# EAGLE design Mergen Ground Station_V2.0 (EAGLE 9.6.2)
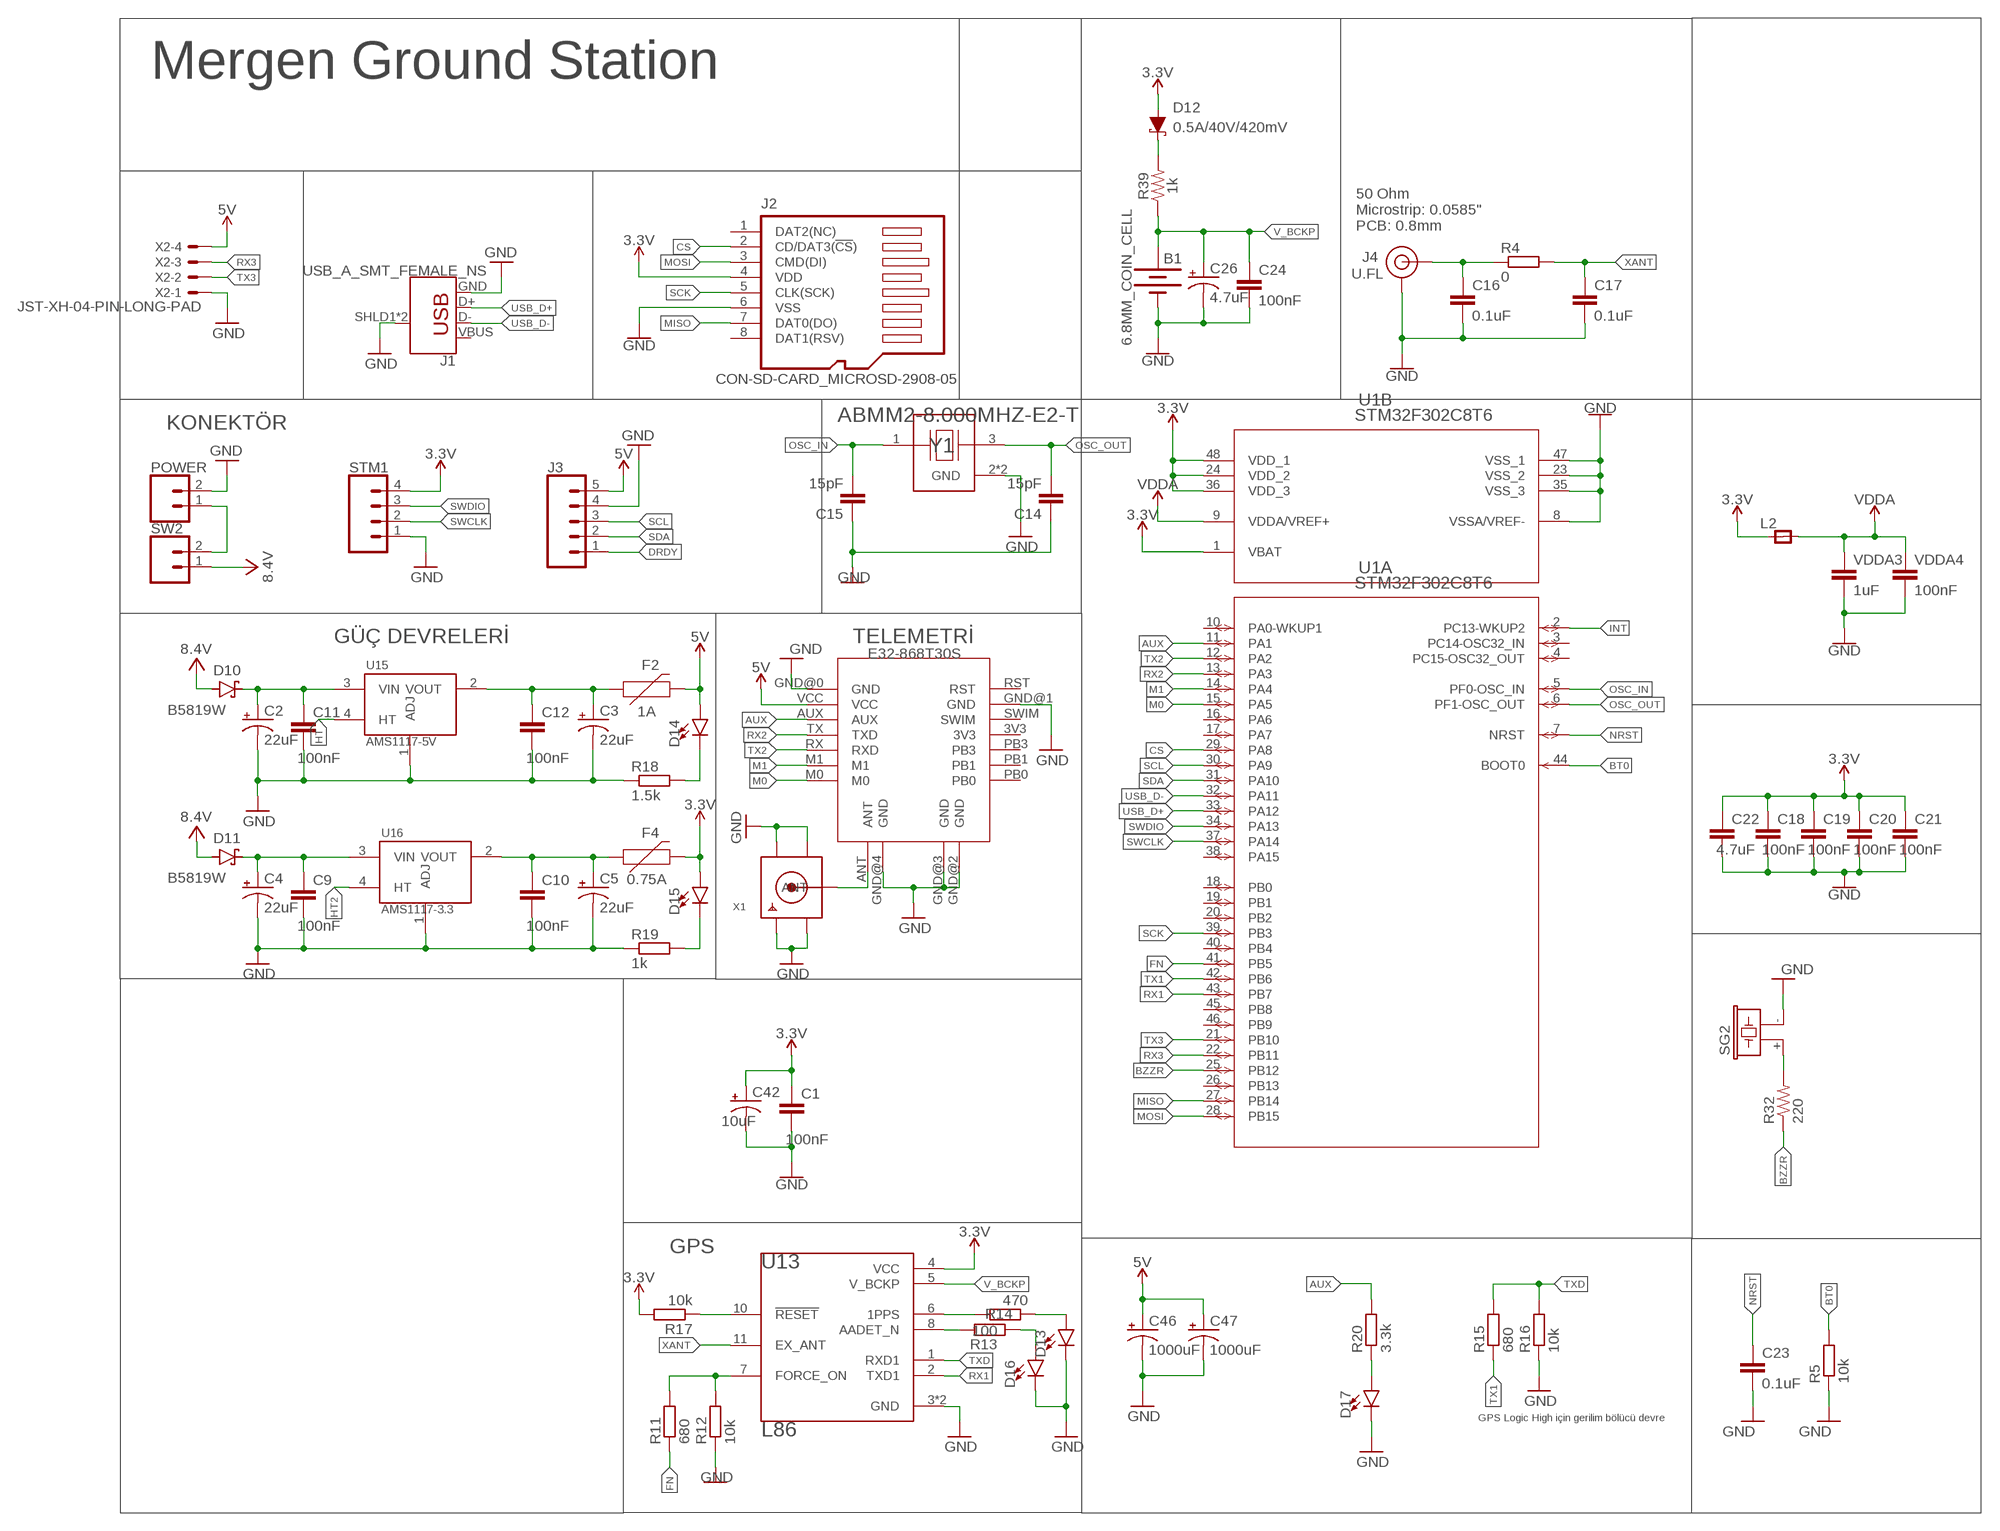
[diagram p0: schematic, sheet 1]

## Parts
B1  6.8MM_COIN_CELL  BATTERY-6.8MM_SMD  [BATTCON-6.8MM]
C1  100nF  C-EUC0603  [C0603]
C2  22uF  CPOL-USCT3528  [CT3528]
C3  22uF  CPOL-USCT3528  [CT3528]
C4  22uF  CPOL-USCT3528  [CT3528]
C5  22uF  CPOL-USCT3528  [CT3528]
C9  100nF  C-EUC0603  [C0603]
C10  100nF  C-EUC0603  [C0603]
C11  100nF  C-EUC0603  [C0603]
C12  100nF  C-EUC0603  [C0603]
C14  15pF  C-EUC0603  [C0603]
C15  15pF  C-EUC0603  [C0603]
C16  0.1uF  C-EUC0603  [C0603]
C17  0.1uF  C-EUC0603  [C0603]
C18  100nF  C-EUC0603  [C0603]
C19  100nF  C-EUC0603  [C0603]
C20  100nF  C-EUC0603  [C0603]
C21  100nF  C-EUC0603  [C0603]
C22  4.7uF  C-EUC0603  [C0603]
C23  0.1uF  C-EUC0603  [C0603]
C24  100nF  C-EUC0603  [C0603]
C26  4.7uF  CPOL-USA/3216-18R  [A/3216-18R]
C42  10uF  10UF-POLAR-EIA3216-16V-10%(TANT)  [EIA3216]
C46  1000uF  CPOL-US150CLZ-1010  [150CLZ-1010]
C47  1000uF  CPOL-US150CLZ-1010  [150CLZ-1010]
D10  B5819W  SCHOTTKY_MBR0520LT1GDO-219  [SODFL3718X115]
D11  B5819W  SCHOTTKY_MBR0520LT1GDO-219  [SODFL3718X115]
D12  0.5A/40V/420mV  DIODE-SCHOTTKY-PMEG4005EJ  [SOD-323]
D13  LED0603  [LED-0603]
D14  LED0603  [LED-0603]
D15  LED0603  [LED-0603]
D16  LED0603  [LED-0603]
D17  LED0603  [LED-0603]
F2  1A  PPTC_HALF-AMP  [1206]
F4  0.75A  PPTC_HALF-AMP  [1206]
J1  USB_A_SMT_FEMALE_NS  [USB-A-S-NOSILK-FEMALE]
J2  CON-SD-CARD_MICROSD-2908-05  [CON-SD-CARD_2908-05]
J3  CONN_05LOCK_LONGPADS  [1X05_LOCK_LONGPADS]
J4  U.FL  U.FL2PIN  [U.FL]
L2  RC-MASTER-SMD_FB_0805MP  [RC-MASTER-SMD_L0805MP]
POWER  CONN_023.5MM-NO_SILK  [SCREWTERMINAL-3.5MM-2-NS]
R4  0  R-EU_R0603  [R0603]
R5  10k  R-EU_R0603  [R0603]
R11  680  R-EU_R0603  [R0603]
R12  10k  R-EU_R0603  [R0603]
R13  100  R-EU_R0603  [R0603]
R14  470  R-EU_R0603  [R0603]
R15  680  R-EU_R0603  [R0603]
R16  10k  R-EU_R0603  [R0603]
R17  10k  R-EU_R0603  [R0603]
R18  1.5k  R-EU_R0603  [R0603]
R19  1k  R-EU_R0603  [R0603]
R20  3.3k  R-EU_R0603  [R0603]
R32  220  0OHM-0603-1/10W-5%  [0603]
R39  1k  1KOHM-0603-1/10W-1%  [0603]
SG2  F/CM12P  [F/CM12P]
STM1  CONN_04  [1X04]
SW2  CONN_023.5MM-NO_SILK  [SCREWTERMINAL-3.5MM-2-NS]
U1  STM32F302C8T6  [LQFP48-7X7MM]
U13  L86  [XCVR_L86]
U14  E32-868T30S  [E32-868T30S]
U15  AMS1117-5V  AMS1117-3.3  [SOT229P700X180-4N]
U16  AMS1117-3.3  [SOT229P700X180-4N]
VDDA3  1uF  0.1UF-0603-25V-(+80/-20%)  [0603]
VDDA4  100nF  0.1UF-0603-25V-(+80/-20%)  [0603]
X1  SMACONNECTOR  [SMA90_DIP]
X2  JST-XH-04-PIN-LONG-PAD  [JST-XH-04-PACKAGE-LONG-PAD]
Y1  ABMM2-8.000MHZ-E2-T  [XTAL_ABMM2-8.000MHZ-E2-T]

## Nets
3.3V: C1.1 C18.1 C19.1 C20.1 C21.1 C22.1 C42.+ D12.A D15.A F4.2 J2.4(VDD) L2.1 R17.2 STM1.4 U1.1(B:VBAT) U1.24(B:VDD_2) U1.36(B:VDD_3) U1.48(B:VDD_1) U13.4(VCC)
5V: C46.+ C47.+ D14.A F2.2 J3.5 U14.VCC X2.4
AUX: R20.2 U1.11(A:PA1) U14.AUX
BT0: R5.2 U1.44(A:BOOT0)
BZZR: R32.1 U1.25(A:PB12)
CS: J2.2(CD/DAT3(!CS!)) U1.29(A:PA8)
DRDY: J3.1
FN: R11.1 U1.41(A:PB5)
GND: B1.- C1.2 C2.- C3.- C4.- C5.- C9.2 C10.2 C11.2 C12.2 C14.1 C15.1 C16.2 C17.2 C18.2 C19.2 C20.2 C21.2 C22.2 C23.2 C24.2 C26.- C42.- C46.- C47.- D13.C D16.C D17.C J1.GND J1.SHLD1(SHIELD) J1.SHLD2(SHIELD) J2.6(VSS) J3.4 J4.1(GND) J4.2(GND) POWER.2 R5.1 R12.1 R16.1 R18.1 R19.1 SG2.- STM1.1 U1.8(B:VSSA/VREF-) U1.23(B:VSS_2) U1.35(B:VSS_3) U1.47(B:VSS_1) U13.3(GND) U13.12(GND) U14.GND@0(GND) U14.GND@1(GND) U14.GND@2(GND) U14.GND@3(GND) U14.GND@4(GND) U15.1(ADJ) U16.1(ADJ) VDDA3.2 VDDA4.2 X1.GND1 X1.GND2 X1.GND3 X1.GND4 X2.1 Y1.2(GND) Y1.4(GND)
HT: U15.4(HT)
HT2: U16.4(HT)
INT: U1.2(A:PC13-WKUP2)
M0: U1.15(A:PA5) U14.M0
M1: U1.14(A:PA4) U14.M1
MISO: J2.7(DAT0(DO)) U1.27(A:PB14)
MOSI: J2.3(CMD(DI)) U1.28(A:PB15)
N$2: D16.A R13.1
N$22: C2.+ C11.1 D10.1(C) U15.3(VIN)
N$23: C3.+ C12.1 F2.1 U15.2(VOUT)
N$24: C4.+ C9.1 D11.1(C) U16.3(VIN)
N$25: C5.+ C10.1 F4.1 U16.2(VOUT)
N$27: U14.ANT X1.ANTENNA(ANT)
N$28: R32.2 SG2.+
N$30: POWER.1 SW2.2
N$31: D12.C R39.2
N$32: R17.1 U13.10(!RESET)
N$33: R14.2 U13.6(1PPS)
N$34: D13.A R14.1
N$35: D14.C R18.2
N$36: D15.C R19.2
N$37: R13.2 U13.8(AADET_N)
N$39: C16.1 J4.FEED(SIGNAL) R4.1
N$40: R11.2 R12.2 U13.7(FORCE_ON)
N$41: D17.A R20.1
NRST: C23.1 U1.7(A:NRST)
OSC_IN: C15.2 U1.5(A:PF0-OSC_IN) Y1.1
OSC_OUT: C14.2 U1.6(A:PF1-OSC_OUT) Y1.3
RX1: U1.43(A:PB7) U13.2(TXD1)
RX2: U1.13(A:PA3) U14.TX(TXD)
RX3: U1.22(A:PB11) X2.3
SCK: J2.5(CLK(SCK)) U1.39(A:PB3)
SCL: J3.3 U1.30(A:PA9)
SDA: J3.2 U1.31(A:PA10)
SWCLK: STM1.2 U1.37(A:PA14)
SWDIO: STM1.3 U1.34(A:PA13)
TX1: R15.1 U1.42(A:PB6)
TX2: U1.12(A:PA2) U14.RX(RXD)
TX3: U1.21(A:PB10) X2.2
TXD: R15.2 R16.2 U13.1(RXD1)
USB_D+: J1.D+ U1.33(A:PA12)
USB_D-: J1.D- U1.32(A:PA11)
V_BCKP: B1.+ C24.1 C26.+ R39.1 U13.5(V_BCKP)
VCC: D10.2(A) D11.2(A) SW2.1 ; supply symbol labelled 8.4V
VDDA: L2.2 U1.9(B:VDDA/VREF+) VDDA3.1 VDDA4.1
XANT: C17.1 R4.2 U13.11(EX_ANT)
Unconnected: J2.1(DAT2(NC)) J2.8(DAT1(RSV)) J2.GND@1(GND) J2.GND@2(GND) J2.GND@3(GND) J2.GND@4(GND) U1.3(A:PC14-OSC32_IN) U1.4(A:PC15-OSC32_OUT) U1.10(A:PA0-WKUP1) U1.16(A:PA6) U1.17(A:PA7) U1.18(A:PB0) U1.19(A:PB1) U1.20(A:PB2) U1.26(A:PB13) U1.38(A:PA15) U1.40(A:PB4) U1.45(A:PB8) U1.46(A:PB9) U14.3V3 U14.PB0 U14.PB1 U14.PB3 U14.RST U14.SWIM

## Notes on the sheet
- Mergen Ground Station
- 50 Ohm 
  Microstrip: 0.0585"
  PCB: 0.8mm
- KONEKTÖR
- GÜÇ DEVRELERİ | TELEMETRİ
- GPS
- GPS Logic High için gerilim bölücü devre

## Power pins joined to a net without a drawn wire
VBUS: J1.VBUS

## Library data of the parts
B1 = SparkFun-Batteries:BATTERY: Battery - Single Cell A variety of battery chemistries, sizes, and footprints. Device List: 20MM_PTH - Coin Cell Battery Holder - 20mm (PTH) <https://www.sparkfun.com/products/783> 6.8MM_PTH - Coin Cell Battery Holder - 6.8MM(SMD) <https://www.digikey.com/product-detail/en/seiko-instruments/MS621FE-FL11E/728-1057-ND/1889208?WT.srch=1&gclid=CNOQ5a6LzdQCFZS2wAodXCkE0g> 12MM_SMD - Coin Cell Battery Holder - 12mm (SMD) <https://www.sparkfun.com/products/10592> 12MM_PTH - Coin Cell Battery Holder - 12mm (PTH) <https://www.sparkfun.com/products/7948> 20MM_SMD - 20mm Coin Cell Battery Holder (SMD) (2 legs) Used on the Big Time Watch Kit <https://www.sparkfun.com/products/11734> 20MM_SMD_4LEGS - Coin Cell Battery Holder - 20mm (SMD) <https://www.sparkfun.com/products/11892> 20MM_SMD_4LEGS_OVERPASTE - Coin Cell Battery Holder - 20mm (SMD) <https://www.sparkfun.com/products/11892> (Over-paste on the legs) 24.5MM_PTH - Coin Cell Battery Holder - 24.5mm (PTH) <https://www.sparkfun.com/products/8863> 9V - 9V Battery Holder - PC Mount Used on the SparkFun SparkPunk Sound Kit <https://www.sparkfun.com/products/11177> and SparkFun SparkPunk Sequencer Kit <https://www.sparkfun.com/products/12707> 18650 - Battery Holder - 18650 (PTH) <https://www.sparkfun.com/products/13113> AA - Battery Holder - 1xAA (PTH) <https://www.sparkfun.com/products/7949> AAA - Battery Holder - 1xAAA (PTH) <https://www.sparkfun.com/products/12718> AA_KIT - Battery Holder - 1xAA (PTH) <https://www.sparkfun.com/products/7949> Special kit package - pads only have exposed copper on one side of the board. AAA_KIT - Battery Holder - 1xAAA (PTH) <https://www.sparkfun.com/products/12718> Special kit package - pads only have exposed copper on one side of the board.; PROD_ID: BATT-13734
C1 C9-C12 C14-C24 = rcl:C-EU: CAPACITOR, European symbol; SPICEPREFIX: C
C2-C5 C26 = rcl:CPOL-US: POLARIZED CAPACITOR, American symbol; SPICEPREFIX: C
C42 = SparkFun-Capacitors:10UF-POLAR: 10.0µF polarized capacitors A capacitor is a passive two-terminal electrical component used to store electrical energy temporarily in an electric field.; PROD_ID: CAP-00811
C46 C47 = adafruit:CPOL-US: POLARIZED CAPACITOR, American symbol
D10 D11 = Diode:SCHOTTKY_: Schottky Diode - Popular parts; CATEGORY: Diode; DESCRIPTION: DIODE SCHOTTKY 20V 500MA SOD123; MANUFACTURER: ON Semiconductor; MPN: MBR0520LT1G; SUB-CATEGORY: Schottky; VALUE: MBR0520LT1G
D12 = SparkFun-DiscreteSemi:DIODE-SCHOTTKY: Schottky diode A Schottky diode is a semiconductor diode which has a low forward voltage drop and a very fast switching action.; PROD_ID: DIO-10955
D13-D17 = SparkFun-LED:LED: LED (Generic) Standard schematic elements and footprints for 5mm, 3mm, 1206, and 0603 sized LEDs. Generic LEDs with no color specified.
F2 F4 = SparkFun-Fuses:PPTC: Resettable Fuse PPTC Resettable Fuse. Really a sort of resistor with a polymeric positive temperature coefficient whose resistance increases dramatically with an increase in temperature. When heated by the power passing through the resistance rises causing the current to be limited, protecting the circuit. This is achieved by the transition of the polymer from a crystalline to an amorphous state where the conductive carbon separates breaking the conductive pathways found in the cool crystalline structure. When a PPTC cools back down it resumes conducting letting the circuit turn back on. SparkFun Products: SparkFun RedBoard - Programmed with Arduino <https://www.sparkfun.com/products/12757> Pro Micro - 5V/16MHz <https://www.sparkfun.com/products/12640> Arduino Pro 328 - 5V/16MHz <https://www.sparkfun.com/products/10915> MP3 Trigger <https://www.sparkfun.com/products/13720>; PROD_ID: RES-08585; VALUE: 6V/0.5A
J1 = SparkFun-Connectors:USB_A: USB-A Connector Male and female variants, as well as PTH and SMT variants SparkFun Products: SparkFun XBee Explorer Dongle <https://www.sparkfun.com/products/11697> PTH Male SparkFun MicroView-USB Programmer <https://www.sparkfun.com/products/12924> SMT Male SparkFun USB Type A Female Breakout <https://www.sparkfun.com/products/12700> SMT Female; PROD_ID: CONN-09520; SF_ID: PRT-09011
J2 = 52101-101-REV-A_v16:CON-SD-CARD_MICROSD-: microSD Connector
J3 = SparkFun-Connectors:CONN_05: Multi connection point. Often used as Generic Header-pin footprint for 0.1 inch spaced/style header connections On any of the 0.1 inch spaced packages, you can populate with these: Break Away Headers - Straight <https://www.sparkfun.com/products/116> (PRT-00116) Break Away Male Headers - Right Angle <https://www.sparkfun.com/products/553> (PRT-00553) Female Headers <https://www.sparkfun.com/products/115> (PRT-00115) Break Away Headers - Machine Pin <https://www.sparkfun.com/products/117> (PRT-00117) Break Away Female Headers - Swiss Machine Pin <https://www.sparkfun.com/products/743> (PRT-00743) For SCREWTERMINALS and SPRING TERMINALS visit here: Screw Terimnals on SparkFun.com <https://www.sparkfun.com/search/results?term=Screw+Terminals> (5mm/3.5mm/2.54mm spacing) This device is also useful as a general connection point to wire up your design to another part of your project. Our various solder wires solder well into these plated through hole pads. Hook-Up Wire - Assortment (Stranded, 22 AWG) <https://www.sparkfun.com/products/11375> (PRT-11375) Hook-Up Wire - Assortment (Solid Core, 22 AWG) <https://www.sparkfun.com/products/11367> (PRT-11367) View the entire wire category on our website here <https://www.sparkfun.com/categories/141> Special notes: Molex polarized connector foot print use with SKU : PRT-08231 with associated crimp pins and housings. 1MM SMD Version SKU: PRT-10208
J4 = SparkFun-Connectors:U.FL2PIN: SMD Antenna Connector - U.FL 2mm height, 3.0mm x 3.0mm receptacle size. SparkFun Products: SparkFun WiFi Shield - ESP8266 <https://www.sparkfun.com/products/13287> SparkFun ESP8266 Thing <https://www.sparkfun.com/products/13231> SparkFun MiniGen - Pro Mini Signal Generator Shield <https://www.sparkfun.com/products/11420>; PROD_ID: CONN-09193; SF_ID: WRL-09144
L2 = 52101-101-REV-A_v16:RC-MASTER-SMD_FB_: FERRITE BEAD
POWER SW2 = SparkFun-Connectors:CONN_02: Multi connection point. Often used as Generic Header-pin footprint for 0.1 inch spaced/style header connections On any of the 0.1 inch spaced packages, you can populate with these: Break Away Headers - Straight <https://www.sparkfun.com/products/116> (PRT-00116) Break Away Male Headers - Right Angle <https://www.sparkfun.com/products/553> (PRT-00553) Female Headers <https://www.sparkfun.com/products/115> (PRT-00115) Break Away Headers - Machine Pin <https://www.sparkfun.com/products/117> (PRT-00117) Break Away Female Headers - Swiss Machine Pin <https://www.sparkfun.com/products/743> (PRT-00743) For SCREWTERMINALS and SPRING TERMINALS visit here: Screw Terimnals on SparkFun.com <https://www.sparkfun.com/search/results?term=Screw+Terminals> (5mm/3.5mm/2.54mm spacing) This device is also useful as a general connection point to wire up your design to another part of your project. Our various solder wires solder well into these plated through hole pads. Hook-Up Wire - Assortment (Stranded, 22 AWG) <https://www.sparkfun.com/products/11375> (PRT-11375) Hook-Up Wire - Assortment (Solid Core, 22 AWG) <https://www.sparkfun.com/products/11367> (PRT-11367) View the entire wire category on our website here <https://www.sparkfun.com/categories/141> Special notes: Molex polarized connector foot print use with: PRT-08233 with associated crimp pins and housings. 2.54_SCREWTERM for use with PRT-10571. 3.5mm Screw Terminal footprints for PRT-08084 5mm Screw Terminal footprints for use with PRT-08432; PROD_ID: CONN-08399
R4 R5 R11-R20 = rcl:R-EU_: RESISTOR, European symbol; SPICEPREFIX: R
R32 = SparkFun-Resistors:0OHM: 0Ω resistor A resistor is a passive two-terminal electrical component that implements electrical resistance as a circuit element. Resistors act to reduce current flow, and, at the same time, act to lower voltage levels within circuits. - Wikipedia; PROD_ID: RES-08609; VALUE: 0
R39 = SparkFun-Resistors:1KOHM: 1kΩ resistor A resistor is a passive two-terminal electrical component that implements electrical resistance as a circuit element. Resistors act to reduce current flow, and, at the same time, act to lower voltage levels within circuits. - Wikipedia; PROD_ID: RES-07856
SG2 = buzzer:F/CM12P: BUZZER Source: Buerklin; OC_FARNELL: unknown; OC_NEWARK: unknown
STM1 = SparkFun-Connectors:CONN_04: Multi connection point. Often used as Generic Header-pin footprint for 0.1 inch spaced/style header connections On any of the 0.1 inch spaced packages, you can populate with these: Break Away Headers - Straight <https://www.sparkfun.com/products/116> (PRT-00116) Break Away Male Headers - Right Angle <https://www.sparkfun.com/products/553> (PRT-00553) Female Headers <https://www.sparkfun.com/products/115> (PRT-00115) Break Away Headers - Machine Pin <https://www.sparkfun.com/products/117> (PRT-00117) Break Away Female Headers - Swiss Machine Pin <https://www.sparkfun.com/products/743> (PRT-00743) For SCREWTERMINALS and SPRING TERMINALS visit here: Screw Terimnals on SparkFun.com <https://www.sparkfun.com/search/results?term=Screw+Terminals> (5mm/3.5mm/2.54mm spacing) This device is also useful as a general connection point to wire up your design to another part of your project. Our various solder wires solder well into these plated through hole pads. Hook-Up Wire - Assortment (Stranded, 22 AWG) <https://www.sparkfun.com/products/11375> (PRT-11375) Hook-Up Wire - Assortment (Solid Core, 22 AWG) <https://www.sparkfun.com/products/11367> (PRT-11367) View the entire wire category on our website here <https://www.sparkfun.com/categories/141> Special notes: Molex polarized connector foot print use with SKU : PRT-08231 with associated crimp pins and housings. 1MM SMD Version SKU: PRT-10208; PROD_ID: CONN-09696
U1 = STM32F302C8T6:STM32F302C8T6; BUILT_BY: EMA_UL_Team; COPYRIGHT: Copyright (C) 2018 Accelerated Designs. All rights reserved; MANUFACTURER_PART_NUMBER: STM32F302C8T6; SOURCELIBRARY: Updates_to_database_2020-10-19; VENDOR: STMicroelectronics
U13 = L86:L86: L86 is an ultra-compact GNSS POT (Patch on Top) module with an embedded 18.4mm × 18.4mm × 4.0mm patch antenna and utilizes the MediaTek new generation GNSS chipset MT3333 that achieves the perfect performance; AVAILABILITY: Unavailable; DESCRIPTION: L86 is an ultra-compact GNSS POT (Patch on Top) module with an embedded 18.4mm × 18.4mm × 4.0mm patch antenna and utilizes the MediaTek new generation GNSS chipset MT3333 that achieves the perfect performance; MF: Quectel; MP: L86; PACKAGE: PowerSFN-8 Quectel; PRICE: None
U14 = E32-868T30S:E32-868T30S: E BYTE E32-868T30S
U15 U16 = AMS1117-3.3:AMS1117-3.3: Sot223/Pkg 1-Amp 3.3-Volt Low Drop Out Voltage Regulatator; AVAILABILITY: Unavailable; DESCRIPTION: Sot223/Pkg 1-Amp 3.3-Volt Low Drop Out Voltage Regulatator; MF: Advanced Monolithic Systems; MP: AMS1117-3.3; PACKAGE: SOT-89 ams; PRICE: None
VDDA3 VDDA4 = SparkFun-Capacitors:0.1UF: 0.1µF ceramic capacitors A capacitor is a passive two-terminal electrical component used to store electrical energy temporarily in an electric field.; PROD_ID: CAP-00810; VALUE: 0.1uF
X1 = adafruit:SMACONNECTOR: SMA Connector 90° DIP SMA Connector, 50 Ohm (4UConnector: 07259)
X2 = Rembrandt Electronics - JST XH Connectors v1-0:JST-XH-04-PIN: JST XH Connector 2 Pin Wire to board connector. Pitch: 2,54 mm, (0.100") Number of pins: 4 Created by Rembrandt Electronics www.rembrandtelectronics.com
Y1 = ABMM2-8.000MHZ-E2-T (1):ABMM2-8.000MHZ-E2-T: Check prices <https://pricing.snapeda.com/parts/ABMM2-8.000MHZ-E2-T/Abracon/view-part?ref=eda>; AVAILABILITY: Good; DESCRIPTION: 8MHz ±20ppm Crystal 18pF 72 Ohms 4-SMD, No Lead; MF: Abracon; MP: ABMM2-8.000MHZ-E2-T; PACKAGE: SMD-4 Abracon; PRICE: None; PURCHASE-URL: https://pricing.snapeda.com/search/part/ABMM2-8.000MHZ-E2-T/?ref=eda

## Board
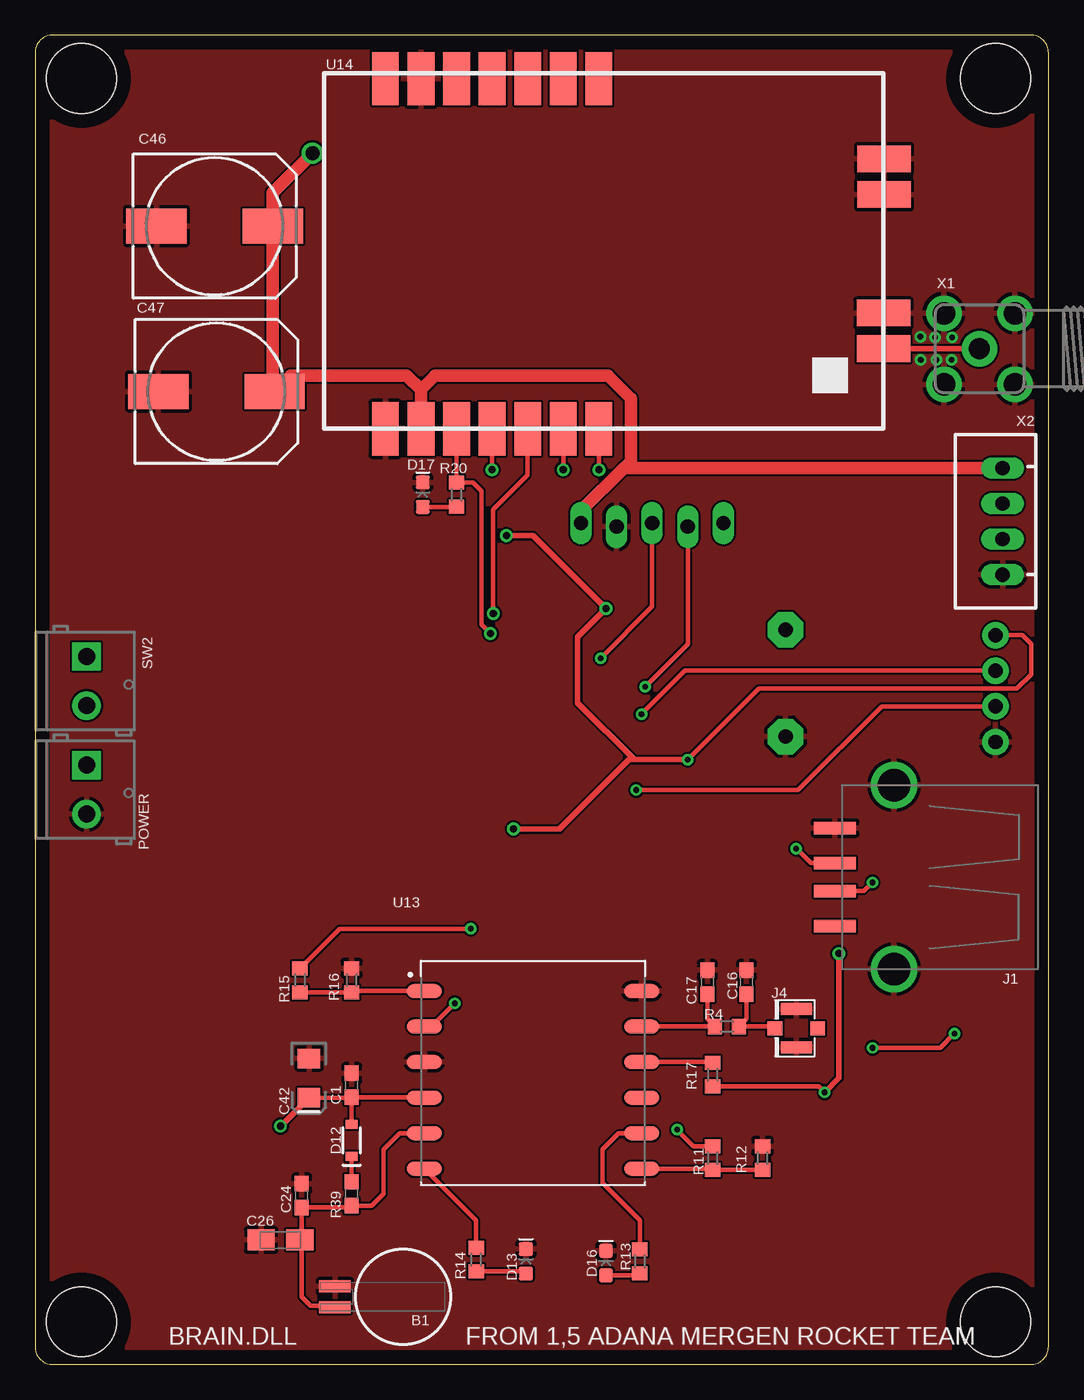
[diagram p1: board, top side]
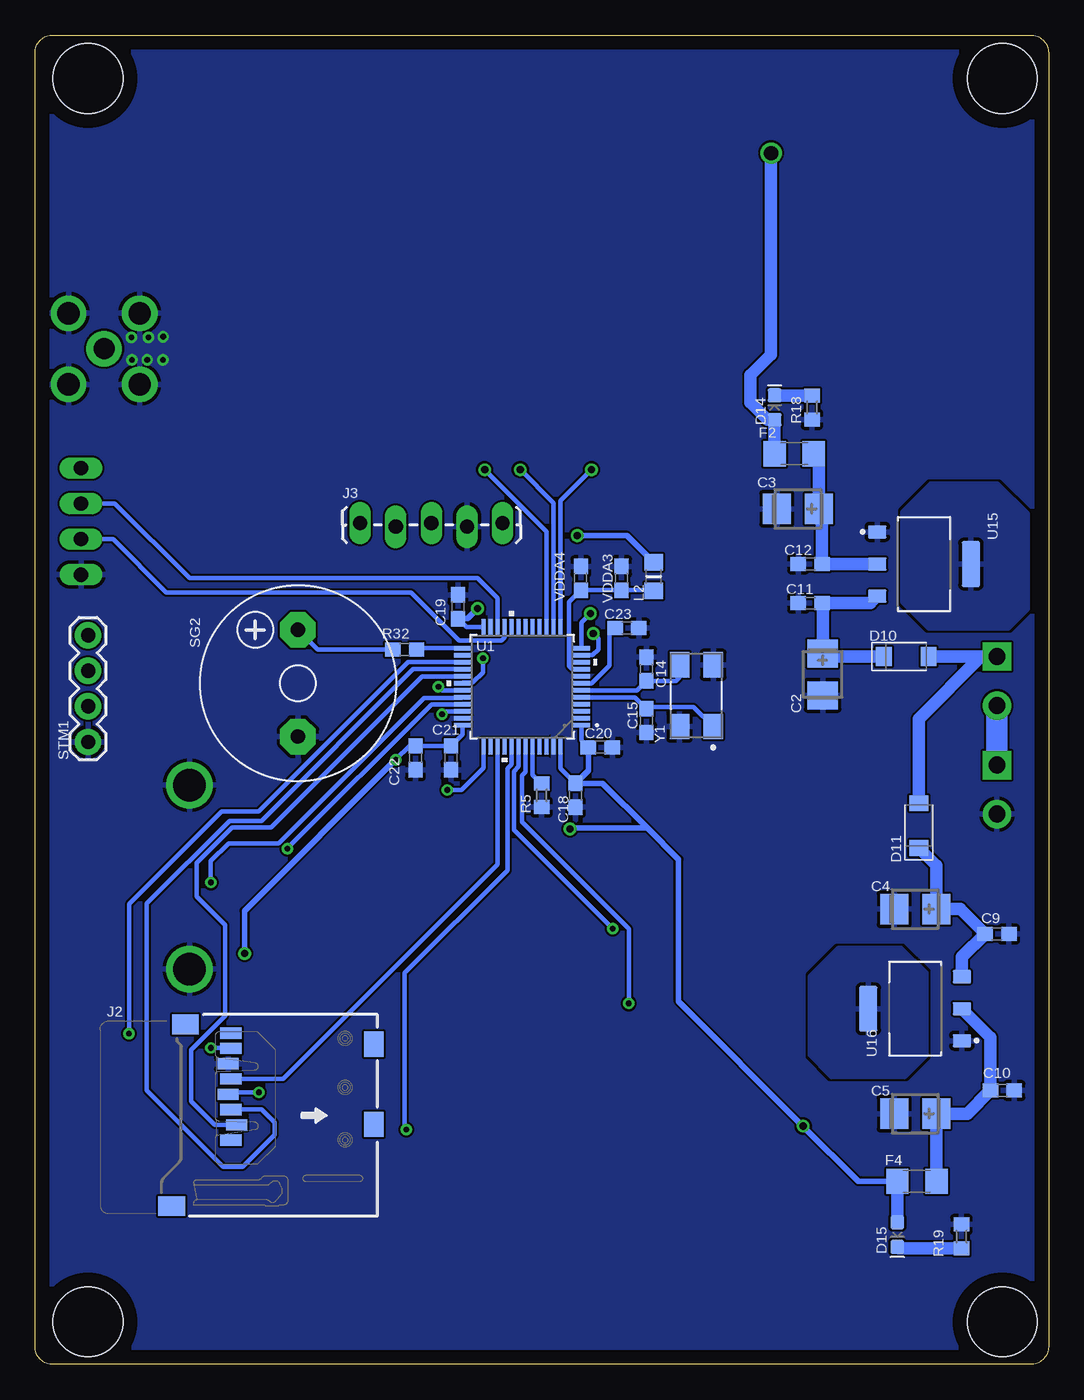
[diagram p2: board, bottom side, seen from below]

Size 72.37 x 94.92 mm. Coordinates in mm from the lower left corner, seen from the top.
Outline: 0,93.65 0,1.27 arc90 1.27,0 71.1,0 arc90 72.37,1.27 72.37,93.65 arc90 71.1,94.92 1.27,94.92 arc90 0,93.65
Copper layers (1*16): Top 0.035mm / dielectric 1.5mm / Bottom 0.035mm
Design rules "default": minimum track width 6mil, minimum drill 0.35mm, track to track 6mil, track to pad 6mil, pad to pad 6mil, via to via 6mil, smd to smd 6mil, copper to edge 40mil, drill to drill 6mil, minimum pad ring 10mil, minimum via ring 8mil, stop-mask expansion 4mil, vias tented up to drill 0mil, thermal gap 10mil
Holes 5 mm at 3.3,91.82 68.58,91.82 3.3,3.05 68.58,3.05

### Footprints (pad centres in the part's own frame; a part is rotated, then mirrored left to right if it is on the bottom)
BATTCON-6.8MM = smd 2.25 x 0.85: + 4.87,0.75; - 4.87,-0.75
C0603 = smd 1.1 x 1: 1 -0.85,0; 2 0.85,0
CT3528 = smd 2 x 2.2: + -1.5,0; - 1.5,0
A/3216-18R = smd 1.95 x 1.5: + 1.375,0; - -1.375,0
EIA3216 = smd 1.4 x 1.6: + 1.4,0; - -1.4,0
150CLZ-1010 = smd 4.3 x 2.5: + 4.15,0; - -4.15,0
SODFL3718X115 = smd 1.115 x 1.361: 1 -1.6,0; 2 1.6,0
SOD-323 = smd 0.63 x 0.83: A 1.15,0; C -1.15,0
LED-0603 = smd 1 x 1: A -0.877,0; C 0.877,0
1206 = smd 1.6 x 1.8: 1 -1.4,0; 2 1.4,0
USB-A-S-NOSILK-FEMALE = smd 3 x 0.9: D+ 6.752,-1; D- 6.752,1; GND 6.752,-3.5; VBUS 6.752,3.5 | drill 2.311: SHLD1 2.54,-6.566; SHLD2 2.54,6.566
CON-SD-CARD_2908-05 = smd 0.8 x 1.5: 1 1.761,3.847; 2 0.669,4.253; 3 -0.423,3.847; 4 -1.515,3.644; 5 -2.607,3.847; 6 -3.7,3.644; 7 -4.792,3.847; 8 -5.884,3.847 | smd 1.397 x 1.905: GND@1 -6.5,0.6; GND@2 6.473,-0.389 | smd 1.803 x 1.397: GND@3 0.631,14.059; GND@4 -5.084,14.059
1X05_LOCK_LONGPADS = drill 1.016 long: 1 0,0; 2 2.54,-0.254; 3 5.08,0; 4 7.62,-0.254; 5 10.16,0
U.FL = smd 2.2 x 0.85: 1 0,1.375; 2 0,-1.375 | smd 1.05 x 1: FEED 1.525,0; NC -1.525,0
RC-MASTER-SMD_L0805MP = smd 1.2 x 1.3: 1 -1.016,0; 2 1.016,0
SCREWTERMINAL-3.5MM-2-NS = drill 1.2 pad 2.032 square: 1 0,0 | drill 1.2 pad 2.032: 2 3.5,0
R0603 = smd 1 x 1.1: 1 -0.85,0; 2 0.85,0
0603 = smd 1.1 x 1: 1 -0.85,0; 2 0.85,0
F/CM12P = drill 1.016 pad 2.54 octagon: + 3.81,0; - -3.81,0
1X04 = drill 1.016 pad 1.88: 1 0,0; 2 2.54,0; 3 5.08,0; 4 7.62,0
LQFP48-7X7MM = smd 1.194 x 0.305: 1 -4.25,2.75; 2 -4.25,2.25; 3 -4.25,1.75; 4 -4.25,1.25; 5 -4.25,0.75; 6 -4.25,0.25; 7 -4.25,-0.25; 8 -4.25,-0.75; 9 -4.25,-1.25; 10 -4.25,-1.75; 11 -4.25,-2.25; 12 -4.25,-2.75; 25 4.25,-2.75; 26 4.25,-2.25; 27 4.25,-1.75; 28 4.25,-1.25; 29 4.25,-0.75; 30 4.25,-0.25; 31 4.25,0.25; 32 4.25,0.75; 33 4.25,1.25; 34 4.25,1.75; 35 4.25,2.25; 36 4.25,2.75 | smd 0.305 x 1.194: 13 -2.75,-4.25; 14 -2.25,-4.25; 15 -1.75,-4.25; 16 -1.25,-4.25; 17 -0.75,-4.25; 18 -0.25,-4.25; 19 0.25,-4.25; 20 0.75,-4.25; 21 1.25,-4.25; 22 1.75,-4.25; 23 2.25,-4.25; 24 2.75,-4.25; 37 2.75,4.25; 38 2.25,4.25; 39 1.75,4.25; 40 1.25,4.25; 41 0.75,4.25; 42 0.25,4.25; 43 -0.25,4.25; 44 -0.75,4.25; 45 -1.25,4.25; 46 -1.75,4.25; 47 -2.25,4.25; 48 -2.75,4.25
XCVR_L86 = smd 2.5 x 1: 1 -7.75,6.35; 2 -7.75,3.81; 3 -7.75,1.27; 4 -7.75,-1.27; 5 -7.75,-3.81; 6 -7.75,-6.35; 7 7.75,-6.35; 8 7.75,-3.81; 9 7.75,-1.27; 10 7.75,1.27; 11 7.75,3.81; 12 7.75,6.35
E32-868T30S = smd 3.81 x 1.905: 3V3 12.3,5.08; AUX -12.7,7.62; GND@0 -12.7,12.7; GND@1 12.3,10.16; M0 -12.7,-2.54; M1 -12.7,0; PB0 12.3,-2.54; PB1 12.3,0; PB3 12.3,2.54; RST 12.3,12.7; RX -12.7,2.54; SWIM 12.3,7.62; TX -12.7,5.08; VCC -12.7,10.16 | smd 1.905 x 3.81: ANT -6.97,-22.86; GND@2 6.57,-22.91; GND@3 4.03,-22.91; GND@4 -4.43,-22.86
SOT229P700X180-4N = smd 0.93 x 1.31: 1 -2.29,-3.345; 2 0,-3.345; 3 2.29,-3.345 | smd 3.24 x 1.31: 4 0,3.345
SMA90_DIP = drill 1.5 pad 2.54: ANTENNA 0,0 | drill 1.6 pad 2.54: GND1 -2.54,2.54; GND2 2.54,2.54; GND3 -2.54,-2.54; GND4 2.54,-2.54
JST-XH-04-PACKAGE-LONG-PAD = drill 1.016 long: 1 -3.81,0; 2 -1.27,0; 3 1.27,0; 4 3.81,0
XTAL_ABMM2-8.000MHZ-E2-T = smd 1.8 x 1.4: 1 -2.2,-1.2; 2 2.2,-1.2; 3 2.2,1.2; 4 -2.2,1.2

### Placement (x,y rotation side)
B1  26.29,4.83 180 top
C1  22.61,19.94 90 top
C2  16.13,49.28 270 bottom
C3  17.91,61.09 180 bottom
C4  9.52,32.51 180 bottom
C5  9.52,17.91 180 bottom
C9  3.68,30.73 0 bottom
C10  3.3,19.56 0 bottom
C11  17.02,54.36 180 bottom
C12  17.02,57.15 180 bottom
C14  28.7,49.66 270 bottom
C15  28.7,45.97 90 bottom
C16  50.8,27.3 90 top
C17  48.01,27.3 90 top
C18  33.78,40.64 270 bottom
C19  42.16,54.1 90 bottom
C20  32,44.07 0 bottom
C21  42.67,43.31 270 bottom
C22  45.21,43.31 270 bottom
C23  30.1,52.58 0 bottom
C24  19.05,12.06 90 top
C26  17.53,8.89 0 top
C42  19.56,20.45 270 top
C46  12.83,81.28 0 top
C47  12.95,69.47 0 top
D10  10.16,50.55 0 bottom
D11  9.27,38.48 90 bottom
D12  22.61,16 90 top
D13  35.05,7.37 90 top
D14  19.56,68.33 90 bottom
D15  10.79,9.27 270 bottom
D16  40.77,7.24 90 top
D17  27.69,62.1 90 top
F2  18.16,65.02 180 bottom
F4  9.4,13.08 180 bottom
J1  63.88,34.8 180 top
J2  62.23,17.78 270 bottom
J3  49.15,60.07 0 bottom
J4  54.36,24 180 top
L2  28.19,56.26 270 bottom
POWER  3.68,42.8 270 top
R4  49.4,24.13 180 top
R5  36.2,40.64 90 bottom
R11  48.39,14.73 270 top
R12  51.94,14.73 270 top
R13  43.18,7.37 90 top
R14  31.5,7.49 90 top
R15  18.92,27.43 270 top
R16  22.61,27.43 270 top
R17  48.39,20.7 270 top
R18  16.89,68.33 90 bottom
R19  6.22,9.14 270 bottom
R20  30.1,62.1 90 top
R32  45.97,51.05 180 bottom
R39  22.61,12.19 90 top
SG2  53.59,48.64 90 bottom
STM1  68.58,44.45 90 bottom
SW2  3.68,50.55 270 top
U1  37.59,48.39 180 bottom
U13  35.56,20.32 0 top
U14  37.72,79.5 90 top
U15  8.89,57.15 270 bottom
U16  9.52,25.4 90 bottom
VDDA3  30.48,56.13 90 bottom
VDDA4  33.4,56.13 90 bottom
X1  67.44,72.52 270 top
X2  69.09,60.2 90 top
Y1  25.15,47.75 90 bottom

### Tracks (layer width: path | path; a pad name or v marks a point on that pad's centre or on a via)
3.3V  (via drill 0.41, 0.51)
  Top 0.305: C42.+ 19.81,19.05 22.56,19.05 C1.1 | C1.1 27.77,19.09 U13.4 | C1.1 D12.A | v46.61,43.18 51.69,48.26 70.1,48.26 71.12,49.28 71.12,51.44 70.48,52.07 STM1.4 | R17.2 55.97,19.85 v56.39,19.43
  Top 0.406: v17.53,17.02 C42.+ 19.81,19.05 | v34.16,38.23 37.46,38.23 42.42,43.18 v46.61,43.18 42.8,43.18 38.73,47.24 38.73,51.94 v40.77,53.98 35.56,59.18 v33.65,59.18 | v57.4,29.34 57.4,20.45 v56.39,19.43
  Bottom 0.305: C20.1 33.34,44.56 U1.1 | C18.1 34.84,42.55 U1.48 | C19.1 41.55,52.64 U1.24 | U1.36 41.84,44.99 C21.1 C22.1 45.63,44.16 v46.61,43.18 | v56.39,19.43 58.45,19.43 J2.4
  Bottom 0.406: F4.2 13.59,13.08 v17.53,17.02 26.42,25.91 26.42,36.07 28.64,38.29 | 28.64,38.29 31.84,41.49 C18.1 32.85,42.42 C20.1 | 28.64,38.29 34.1,38.29 v34.16,38.23 | C19.1 41.49,53.25 v40.77,53.98 | L2.1 30.1,59.18 v33.65,59.18 | v46.61,43.18 57.4,32.38 v57.4,29.34
  Bottom 0.889: F4.2 D15.A
5V  (via drill 1.02)
  Top 0.889: v19.81,86.49 16.98,83.65 C46.+ 16.98,69.6 C47.+ 18.25,70.61 26.54,70.61 27.56,69.6 | 27.56,69.6 U14.VCC | J3.5 38.99,60.96 42.04,64.01 | 27.56,69.6 28.58,70.61 40.89,70.61 42.54,68.96 42.54,64.52 42.04,64.01 | X2.4 42.04,64.01
  Bottom 0.889: F2.2 D14.A 20.07,67.45 21.29,68.67 21.29,70.62 19.81,72.1 v19.81,86.49
AUX  (via drill 0.51)
  Top 0.305: U14.AUX R20.2 31.28,62.95 31.88,62.36 31.88,52.83 v32.51,52.2
  Bottom 0.305: U1.11 32.55,50.64 32.13,51.05 32.13,51.82 v32.51,52.2
BT0
  Bottom 0.305: U1.44 36.84,42.1 36.23,41.49 R5.2
BZZR
  Bottom 0.305: U1.25 45.04,51.14 R32.1
CS
  Bottom 0.305: U1.29 44.72,49.14 55.5,38.35 58.29,38.35 60.83,35.81 60.83,33.4 58.8,31.37 58.8,24.89 61.21,22.48 61.21,18.8 59.53,17.11 J2.2
FN  (via drill 0.41)
  Top 0.305: v45.85,16.76 47.03,15.58 R11.1
  Bottom 0.305: U1.41 38.34,42.83 38.63,42.54 38.63,35.28 45.97,27.94 45.97,16.89 v45.85,16.76
GND  (via drill 0.41)
  other vias: 63.22,73.38 64.26,73.33 65.48,73.33 65.46,71.73 64.36,71.73 63.25,71.73
  pour Top (rank 2): -0.25,95.25 72.9,95.25 72.9,-0.25 -0.25,-0.25
  pour Bottom (rank 2): -0.25,95.38 72.9,95.38 72.9,-0.38 -0.25,-0.38
HT
  pour Bottom: 10.41,54.48 8.51,52.58 2.92,52.58 1.52,53.98 1.52,60.71 3.68,62.87 8.38,62.87 10.41,60.83
HT2
  pour Bottom: 8.76,22.1 8.76,27.94 10.54,29.72 14.99,29.72 17.02,27.69 17.02,22.1 15.49,20.57 10.29,20.57
M0  (via drill 0.51)
  Top 0.305: v40.26,63.88 U14.M0
  Bottom 0.305: U1.15 35.84,59.46 v40.26,63.88
M1  (via drill 0.51)
  Top 0.305: v37.72,63.88 U14.M1
  Bottom 0.305: U1.14 35.34,61.5 v37.72,63.88
MISO  (via drill 0.41)
  Top 0.305: v65.66,23.62 64.64,22.61 v59.82,22.61
  Bottom 0.305: U1.27 45.75,50.14 56.39,39.5 59.05,39.5 65.66,32.89 v65.66,23.62 | J2.7 58.42,22.61 v59.82,22.61
MOSI
  Bottom 0.305: U1.28 45.36,49.64 56.18,38.81 58.48,38.81 64.39,32.91 64.39,19.56 58.93,14.1 57.53,14.1 55.24,16.38 55.24,17.27 56.18,18.2 J2.3
N$2
  Top 0.305: D16.A 43.03,6.36 R13.1
N$22
  Bottom 0.889: D10.1 15.9,50.55 C2.+ 16.13,54.32 C11.1 12.74,54.36 U15.3
N$23
  Bottom 0.889: U15.2 C12.1 16.17,60.85 C3.+ 16.41,64.67 F2.1
N$24
  Bottom 0.889: D11.1 8.02,35.63 C4.+ 6.31,32.51 C9.1 6.18,29.09 U16.3
N$25
  Bottom 0.889: U16.2 4.15,23.37 C10.1 5.8,17.91 C5.+ 8.02,13.11 F4.1
N$27
  Top 0.406: U14.ANT 67.42,72.53 X1.ANTENNA
N$28
  Bottom 0.305: R32.2 52.2,51.05 SG2.+
N$30
  Bottom 1.524: SW2.2 POWER.1
N$31
  Top 0.305: D12.C R39.2
N$32
  Top 0.305: U13.10 48.35,21.59 R17.1
N$33
  Top 0.305: U13.6 31.5,10.28 R14.2
N$34
  Top 0.305: R14.1 34.9,6.64 D13.A
N$35
  Bottom 0.889: R18.2 19.53,69.18 D14.C
N$36
  Bottom 0.889: D15.C 10.69,8.29 R19.2
N$37
  Top 0.305: U13.8 41.66,16.51 40.51,15.37 40.51,12.95 43.18,10.29 R13.2
N$39
  Top 0.305: J4.FEED 52.7,24.13 R4.1 50.8,24.68 C16.1
N$40
  Top 0.305: U13.7 48.3,13.97 R11.2 R12.2
N$41
  Top 0.305: D17.A 30.07,61.23 R20.1
NRST
  Bottom 0.305: U1.7 32.64,48.64 31.37,49.91 31.37,52.16 C23.1
OSC_IN
  Bottom 0.305: Y1.1 25.35,46.95 28.58,46.95 C15.2 29.52,47.64 U1.5
OSC_OUT
  Bottom 0.305: Y1.3 26.35,49.06 26.6,48.81 C14.2 29.38,48.13 U1.6
RX1  (via drill 0.41)
  Top 0.305: v29.97,25.78 28.32,24.13 U13.2
  Bottom 0.305: U1.43 37.34,42.29 37.59,42.04 37.59,38.73 29.97,31.11 v29.97,25.78
RX2  (via drill 0.51)
  Top 0.305: v32.64,63.88 U14.TX
  Bottom 0.305: U1.13 34.84,61.68 v32.64,63.88
RX3
  Bottom 0.305: U1.22 39.34,54.71 40.77,56.13 61.34,56.13 66.68,61.47 X2.3
SCK
  Bottom 0.305: U1.39 39.34,35.72 54.67,20.39 J2.5
SCL  (via drill 0.41)
  Top 0.305: v40.39,50.42 44.07,54.1 J3.3
  Bottom 0.305: U1.30 41.8,48.68 41.12,48.68 40.39,49.41 v40.39,50.42
SDA  (via drill 0.41)
  Top 0.305: v43.56,48.39 46.61,51.44 J3.2
  Bottom 0.305: U1.31 43.31,48.14 v43.56,48.39
SWCLK  (via drill 0.41)
  Top 0.305: v42.93,41.02 54.48,41.02 60.45,46.99 STM1.2
  Bottom 0.305: U1.37 40.34,42.59 41.91,41.02 v42.93,41.02
SWDIO  (via drill 0.41)
  Top 0.305: v43.31,46.43 46.41,49.53 STM1.3
  Bottom 0.305: U1.34 43.1,46.64 v43.31,46.43
TX1  (via drill 0.41)
  Top 0.305: v31.12,31.11 21.76,31.11 R15.1
  Bottom 0.305: U1.42 37.84,42.69 38.18,42.35 38.18,38.18 v31.12,31.11
TX2  (via drill 0.51)
  Top 0.305: v32.72,53.61 32.72,61.04 35.18,63.5 U14.RX
  Bottom 0.305: U1.12 33.34,52.99 v32.72,53.61
TX3
  Bottom 0.305: U1.21 38.84,51.91 39.06,51.69 42.08,51.69 45.51,55.12 62.99,55.12 66.8,58.93 X2.2
TXD
  Top 0.305: U13.1 22.69,26.67 R16.2 R15.2
USB_D+  (via drill 0.41)
  Top 0.305: v54.36,36.83 55.39,35.8 J1.D+
  Bottom 0.305: U1.33 44.05,47.14 v54.36,36.83
USB_D-  (via drill 0.41)
  Top 0.305: v59.82,34.42 59.2,33.8 J1.D-
  Bottom 0.305: U1.32 41.88,47.59 44.6,47.59 54.98,37.21 58.55,37.21 59.82,35.94 v59.82,34.42
V_BCKP
  Top 0.305: U13.5 26.04,16.51 24.89,15.37 24.89,12.19 24.04,11.34 R39.1 22.48,11.21 C24.1 19.05,9.04 C26.+ 19.05,8.74 19.05,4.83 19.69,4.19 21.3,4.19 B1.+
VCC
  Bottom 0.889: D10.2 SW2.1 4.83,50.55 9.27,46.1 D11.2
VDDA
  Bottom 0.305: L2.2 28.23,55.28 VDDA3.1 VDDA4.1 34.24,54.44 34.24,49.86 34.02,49.64 U1.9
XANT
  Top 0.305: U13.11 R4.2 48.01,24.68 C17.1

### Text on the board
tPlace: BRAIN.DLL | FROM 1,5 ADANA MERGEN ROCKET TEAM